# EAGLE design 12706 (EAGLE 6.6.0)
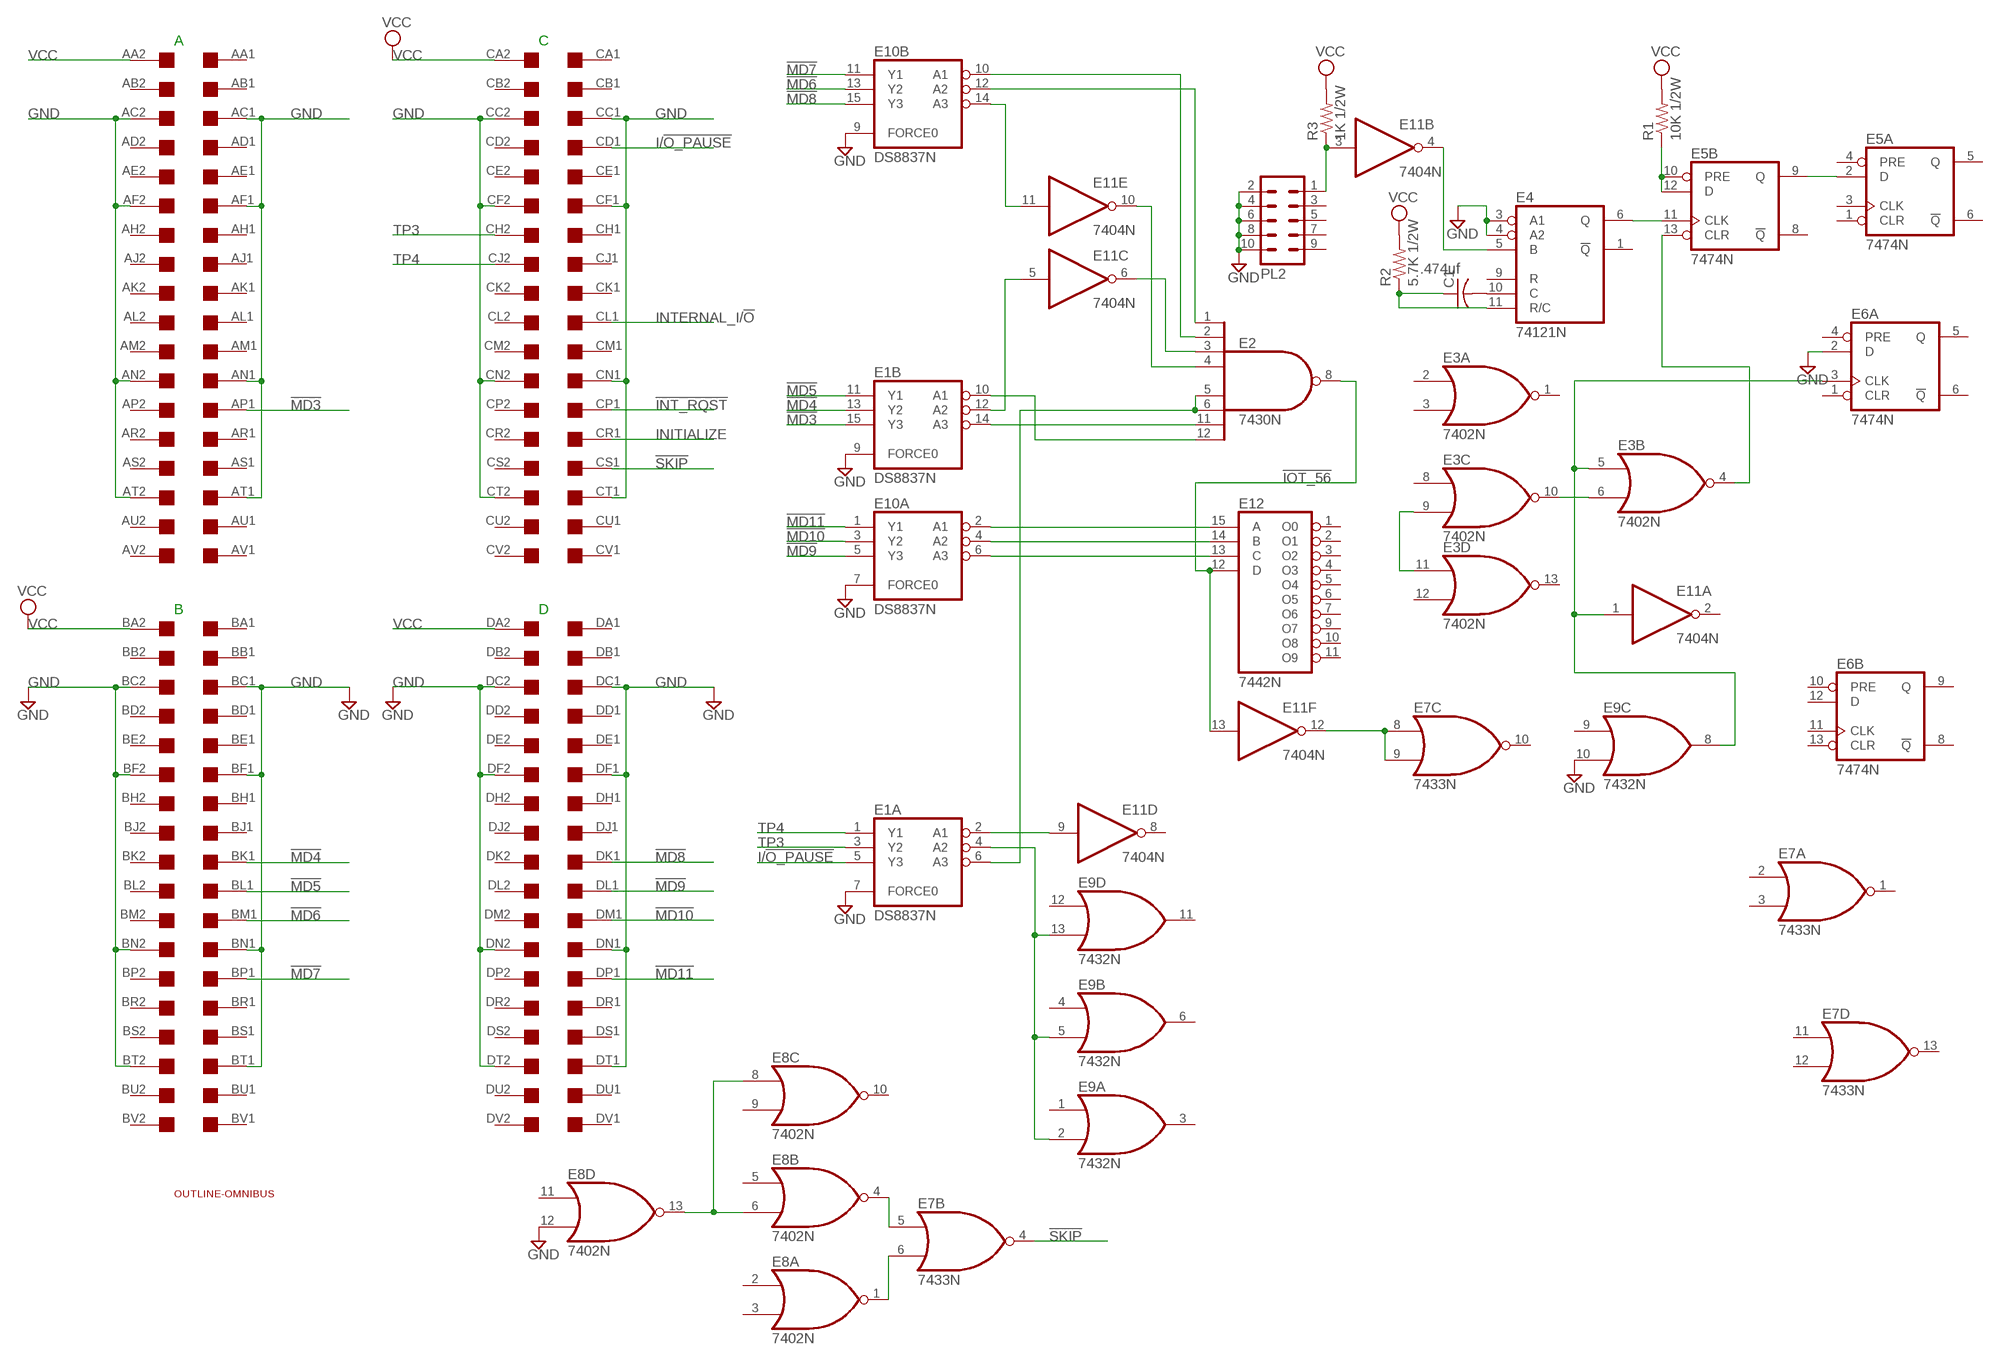
[diagram p0: schematic, sheet 1]

## Parts
C1  .474uf  C-US050-045X075  [C050-045X075]
E1  DS8837N  [DIL16]
E2  7430N  [DIL14]
E3  7402N  [DIL14]
E4  74121N  [DIL14]
E5  7474N  74S74N  [DIL14]
E6  7474N  74S74N  [DIL14]
E7  7433N  74LS33N  [DIL14]
E8  7402N  [DIL14]
E9  7432N  [DIL14]
E10  DS8837N  [DIL16]
E11  7404N  [DIL14]
E12  7442N  74LS42N  [DIL16]
PL2  10H  [10H]
R1  10K 1/2W  R-US_0204/7  [0204/7]
R2  5.7K 1/2W  R-US_0204/7  [0204/7]
R3  1K 1/2W  R-US_0204/7  [0204/7]
U$1  QUAD  [EDGE-CON8]
U$2  OUTLINE-OMNIBUS  [OMNIBUS]

## Nets
!INT_RQST: U$1.CP1
!IOT_56: E2.8(O) E11.13(F:I) E12.12(D)
!MD3: E1.15(B:Y3) U$1.AP1
!MD4: E1.13(B:Y2) U$1.BK1
!MD5: E1.11(B:Y1) U$1.BL1
!MD6: E10.13(B:Y2) U$1.BM1
!MD7: E10.11(B:Y1) U$1.BP1
!MD8: E10.15(B:Y3) U$1.DK1
!MD9: E10.5(A:Y3) U$1.DL1
!MD10: E10.3(A:Y2) U$1.DM1
!MD11: E10.1(A:Y1) U$1.DP1
!SKIP [Power]: E7.4(B:O) U$1.CS1
GND [Power]: E1.7(A:FORCE0) E1.9(B:FORCE0) E4.3(A1) E4.4(A2) E6.2(A:D) E8.12(D:I1) E9.10(C:I1) E10.7(A:FORCE0) E10.9(B:FORCE0) PL2.2 PL2.4 PL2.6 PL2.8 PL2.10 U$1.AC1 U$1.AC2 U$1.AF1 U$1.AF2 U$1.AN1 U$1.AN2 U$1.AT1 U$1.AT2 U$1.BC1 U$1.BC2 U$1.BF1 U$1.BF2 U$1.BN1 U$1.BN2 U$1.BT1 U$1.BT2 U$1.CC1 U$1.CC2 U$1.CF1 U$1.CF2 U$1.CN1 U$1.CN2 U$1.CT1 U$1.CT2 U$1.DC1 U$1.DC2 U$1.DF1 U$1.DF2 U$1.DN1 U$1.DN2 U$1.DT1 U$1.DT2
I/!O_PAUSE: E1.5(A:Y3) U$1.CD1
INITIALIZE: U$1.CR1
INTERNAL_I/!O: U$1.CL1
N$1: E1.14(B:A3) E2.11(I6)
N$2: E1.10(B:A1) E2.12(I7)
N$3: E10.2(A:A1) E12.15(A)
N$4: E10.4(A:A2) E12.14(B)
N$5: E10.6(A:A3) E12.13(C)
N$6 [Power]: E7.6(B:I1) E8.1(A:O)
N$7: E7.8(C:I0) E7.9(C:I1) E11.12(F:O)
N$8: E1.2(A:A1) E11.9(D:I)
N$9 [Power]: E1.4(A:A2) E9.2(A:I1) E9.5(B:I1) E9.13(D:I1)
N$10: E1.6(A:A3) E2.5(I4) E2.6(I5)
N$11: E2.4(I3) E11.10(E:O)
N$12: E2.1(I0) E10.12(B:A2)
N$13: E2.2(I1) E10.10(B:A1)
N$14: E2.3(I2) E11.6(C:O)
N$15: E1.12(B:A2) E11.5(C:I)
N$16: E10.14(B:A3) E11.11(E:I)
N$17: E7.5(B:I0) E8.4(B:O)
N$18: E8.6(B:I1) E8.8(C:I0) E8.13(D:O)
N$19: C1.1 E4.11(R/C) R2.1
N$20: E5.2(A:D) E5.9(B:Q)
N$21: E5.10(B:PRE) E5.12(B:D) R1.1
N$22: E3.6(B:I1) E3.10(C:O)
N$23: E3.9(C:I1) E3.11(D:I0)
N$24: C1.2 E4.10(C)
N$25: E4.6(Q) E5.11(B:CLK)
N$26: E4.5(B) E11.4(B:O)
N$27: E11.3(B:I) PL2.1 R3.1
N$29: E3.4(B:O) E5.13(B:CLR)
N$30: E3.5(B:I0) E6.3(A:CLK) E9.8(C:O) E11.1(A:I)
TP3: E1.3(A:Y2) U$1.CH2
TP4: E1.1(A:Y1) U$1.CJ2
VCC [Power]: R1.2 R2.2 R3.2 U$1.AA2 U$1.BA2 U$1.CA2 U$1.DA2
Unconnected: E3.1(A:O) E3.2(A:I0) E3.3(A:I1) E3.8(C:I0) E3.12(D:I1) E3.13(D:O) E4.1(!Q) E4.9(R) E5.1(A:CLR) E5.3(A:CLK) E5.4(A:PRE) E5.5(A:Q) E5.6(A:!Q) E5.8(B:!Q) E6.1(A:CLR) E6.4(A:PRE) E6.5(A:Q) E6.6(A:!Q) E6.8(B:!Q) E6.9(B:Q) E6.10(B:PRE) E6.11(B:CLK) E6.12(B:D) E6.13(B:CLR) E7.1(A:O) E7.2(A:I0) E7.3(A:I1) E7.10(C:O) E7.11(D:I0) E7.12(D:I1) E7.13(D:O) E8.2(A:I0) E8.3(A:I1) E8.5(B:I0) E8.9(C:I1) E8.10(C:O) E8.11(D:I0) E9.1(A:I0) E9.3(A:O) E9.4(B:I0) E9.6(B:O) E9.9(C:I0) E9.11(D:O) E9.12(D:I0) E11.2(A:O) E11.8(D:O) E12.1(O0) E12.2(O1) E12.3(O2) E12.4(O3) E12.5(O4) E12.6(O5) E12.7(O6) E12.9(O7) E12.10(O8) E12.11(O9) PL2.3 PL2.5 PL2.7 PL2.9 U$1.AA1 U$1.AB1 U$1.AB2 U$1.AD1 U$1.AD2 U$1.AE1 U$1.AE2 U$1.AH1 U$1.AH2 U$1.AJ1 U$1.AJ2 U$1.AK1 U$1.AK2 U$1.AL1 U$1.AL2 U$1.AM1 U$1.AM2 U$1.AP2 U$1.AR1 U$1.AR2 U$1.AS1 U$1.AS2 U$1.AU1 U$1.AU2 U$1.AV1 U$1.AV2 U$1.BA1 U$1.BB1 U$1.BB2 U$1.BD1 U$1.BD2 U$1.BE1 U$1.BE2 U$1.BH1 U$1.BH2 U$1.BJ1 U$1.BJ2 U$1.BK2 U$1.BL2 U$1.BM2 U$1.BP2 U$1.BR1 U$1.BR2 U$1.BS1 U$1.BS2 U$1.BU1 U$1.BU2 U$1.BV1 U$1.BV2 U$1.CA1 U$1.CB1 U$1.CB2 U$1.CD2 U$1.CE1 U$1.CE2 U$1.CH1 U$1.CJ1 U$1.CK1 U$1.CK2 U$1.CL2 U$1.CM1 U$1.CM2 U$1.CP2 U$1.CR2 U$1.CS2 U$1.CU1 U$1.CU2 U$1.CV1 U$1.CV2 U$1.DA1 U$1.DB1 U$1.DB2 U$1.DD1 U$1.DD2 U$1.DE1 U$1.DE2 U$1.DH1 U$1.DH2 U$1.DJ1 U$1.DJ2 U$1.DK2 U$1.DL2 U$1.DM2 U$1.DP2 U$1.DR1 U$1.DR2 U$1.DS1 U$1.DS2 U$1.DU1 U$1.DU2 U$1.DV1 U$1.DV2

## Notes on the sheet
- A | C
- B | D

## Power pins joined to a net without a drawn wire
GND: E1.8(P:GND) E2.7(GND) E3.7(P:GND) E4.7(GND) E5.7(P:GND) E6.7(P:GND) E7.7(P:GND) E8.7(P:GND) E9.7(P:GND) E10.8(P:GND) E11.7(P:GND) E12.8(GND)
VCC: E1.16(P:VCC) E2.14(VCC) E3.14(P:VCC) E4.14(VCC) E5.14(P:VCC) E6.14(P:VCC) E7.14(P:VCC) E8.14(P:VCC) E9.14(P:VCC) E10.16(P:VCC) E11.14(P:VCC) E12.16(VCC)

## Library data of the parts
C1 = rcl:C-US: CAPACITOR, American symbol
E1 E10 = dec-con:DS8837: Hex inverting LINE RECEIVER
E2 = 74xx-us:74*30: 8-input NAND gate
E3 E8 = 74xx-us:74*02: Quad 2-input NOR gate
E4 = 74xx-us:74*121: Monostable MULTIVIBRATOR, schmitt trigger inputs
E5 E6 = 74xx-us:74*74: Dual D type positive edge triggered FLIP FLOP, preset and clear
E7 = 74xx-us:74*33: Quad 2-input NOR buffer, open collector
E9 = 74xx-us:74*32: Quad 2-input OR gate
E11 = 74xx-us:74*04: Hex INVERTER
E12 = 74xx-us:74*42: 4-line to 10-line DECODER (1-of-10)
PL2 = con-harting-h:10H: CONNECTOR; OC_FARNELL: unknown; OC_NEWARK: unknown
R1-R3 = rcl:R-US_: RESISTOR, American symbol
U$1 = dec-con:QUAD: Quad-Height DEC board
U$2 = dec-con:OUTLINE-*: Board outlines for DEC boards.

## Net classes
1 Power: width 0.381 mm, drill 0.381 mm, clearance 0.381 mm

## Board
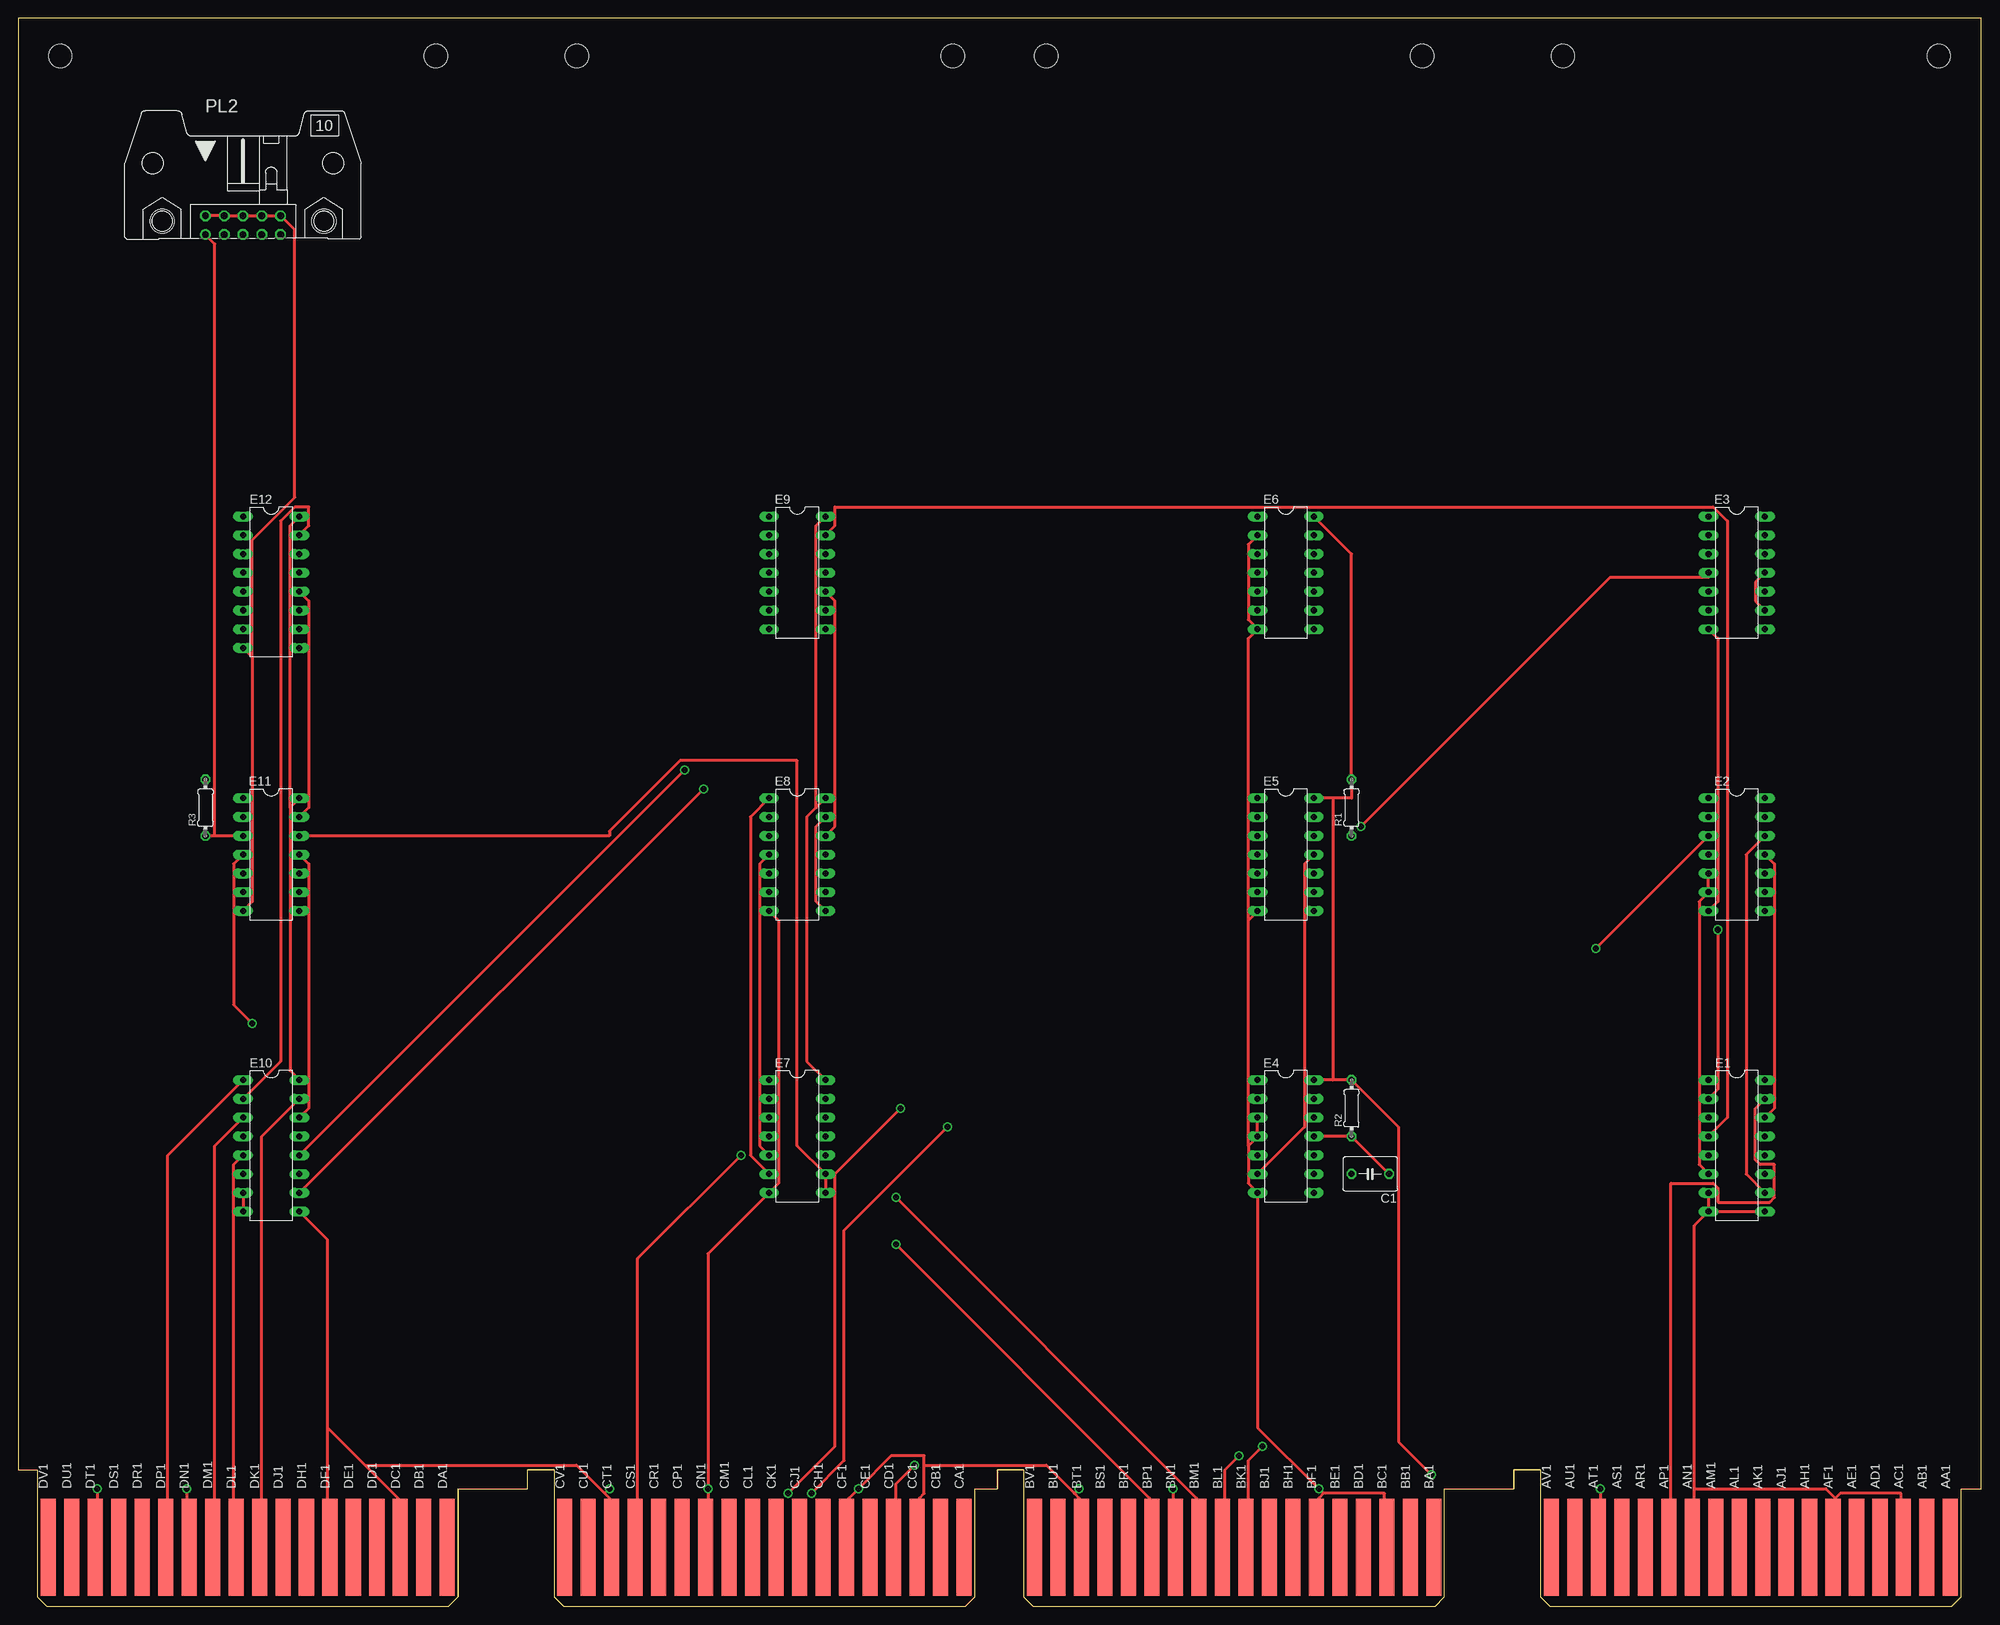
[diagram p1: board, top side]
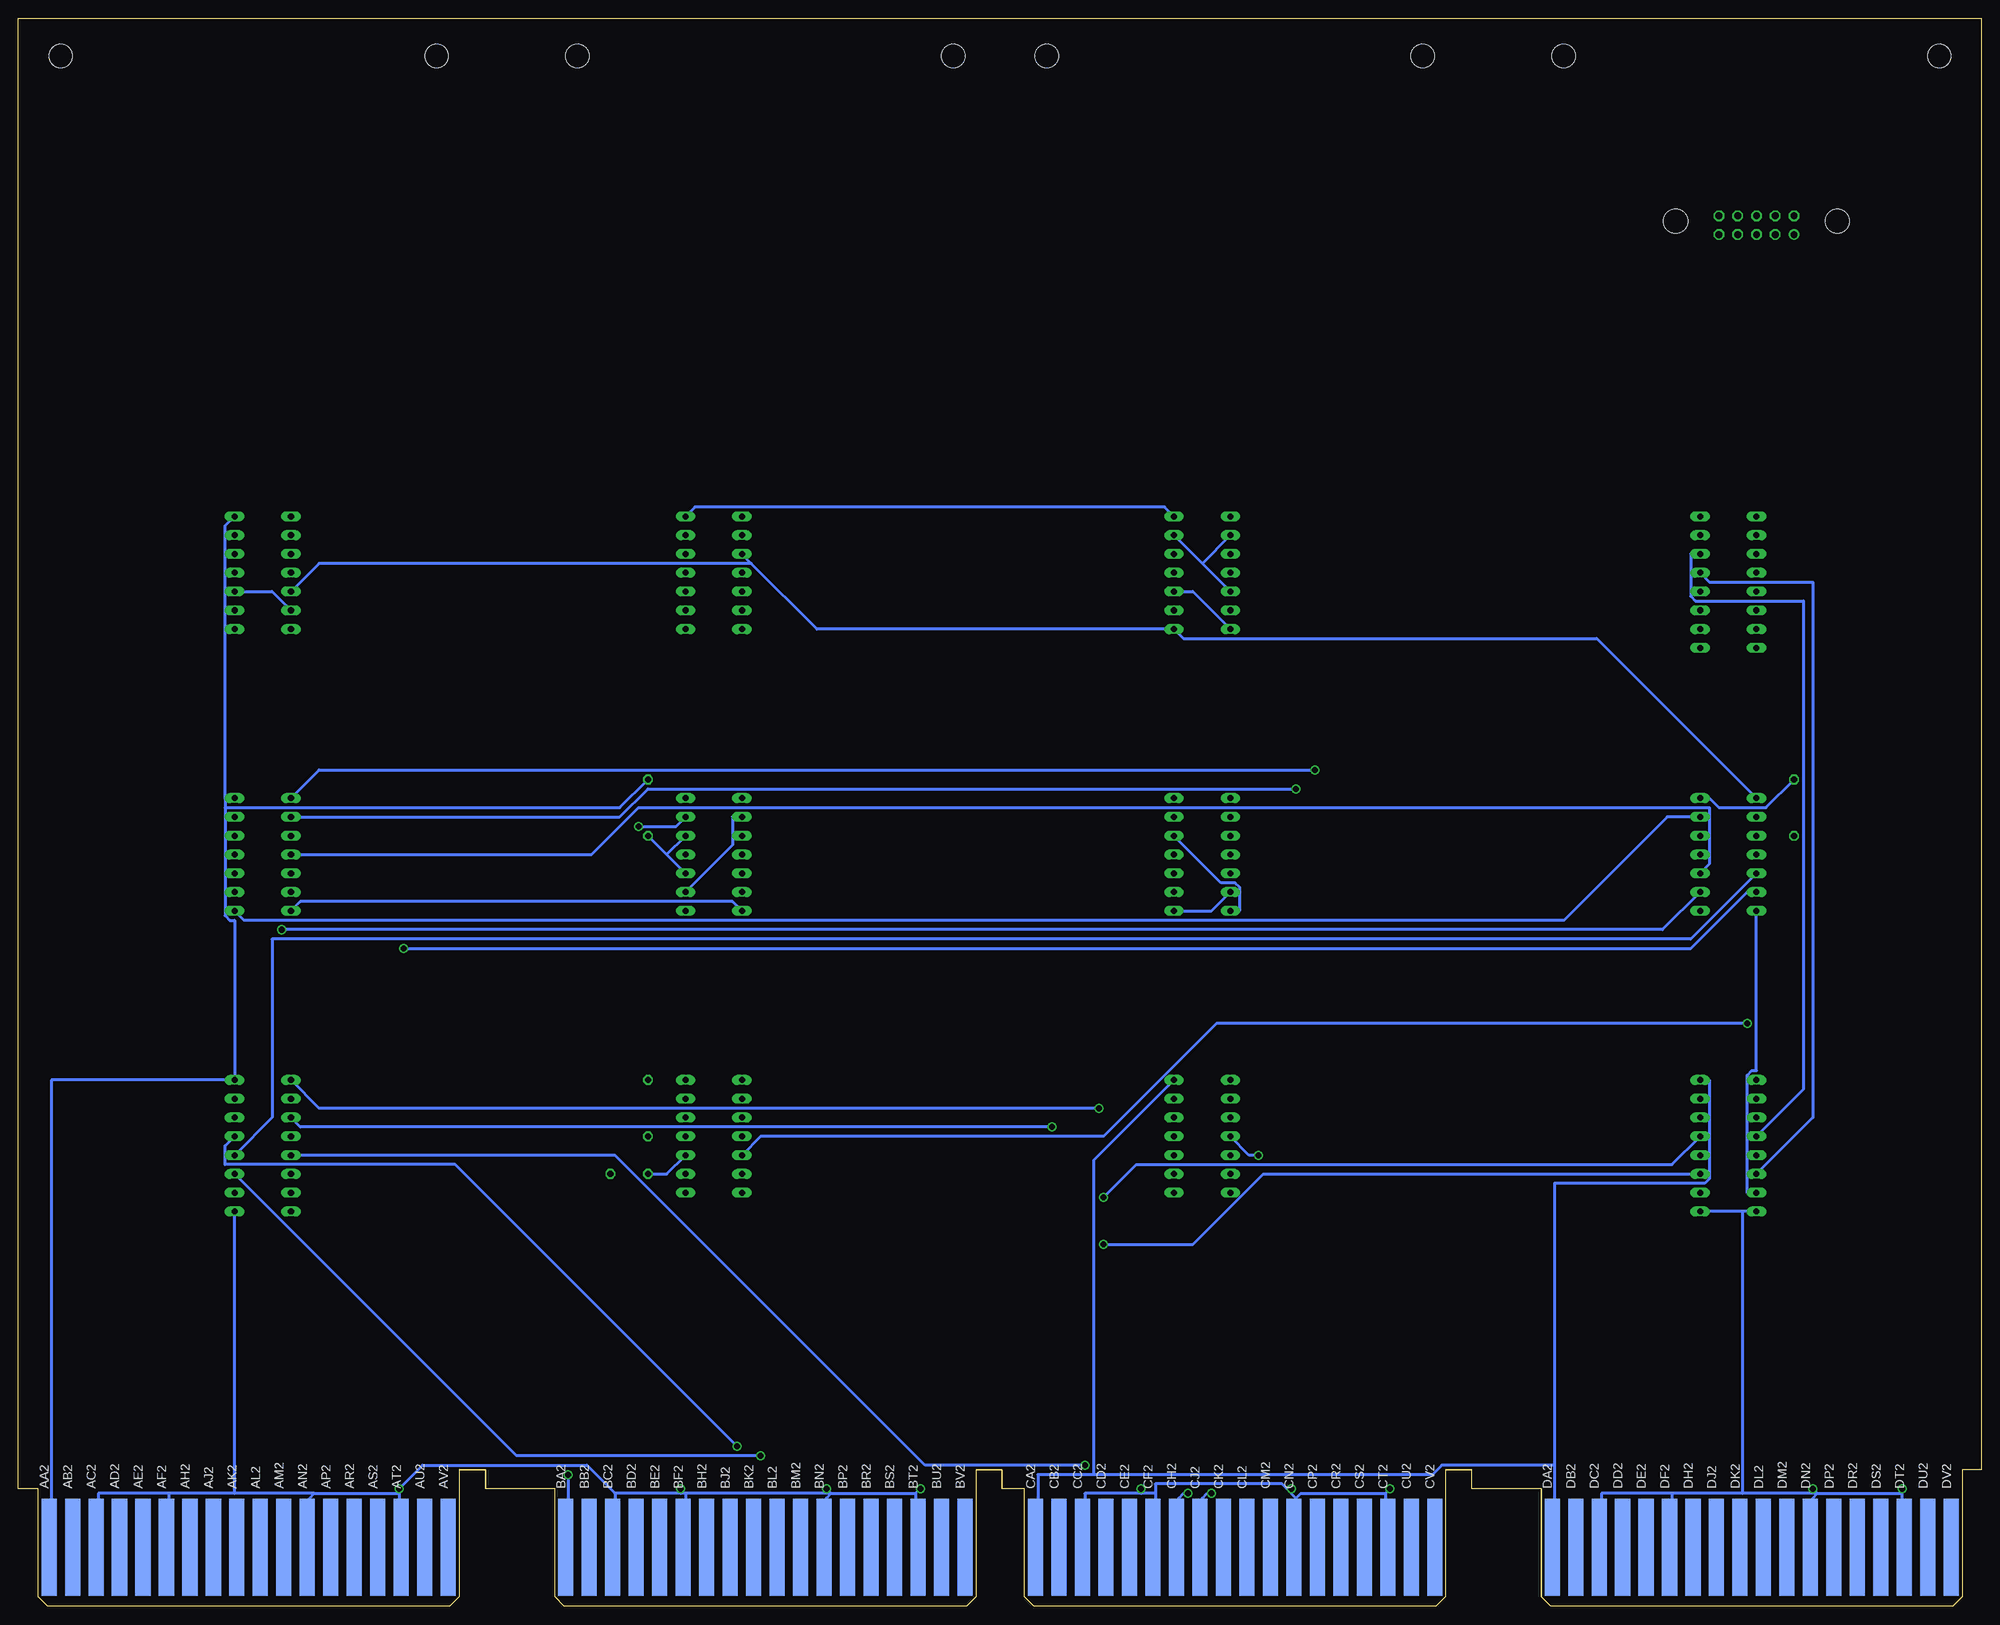
[diagram p2: board, bottom side, seen from below]

Size 265.3 x 214.63 mm. Coordinates in mm from the lower left corner, seen from the top.
Copper layers (1+16): Top 0.035mm / dielectric 1.5mm / Bottom 0.035mm
Design rules "16mils": minimum track width 16mil, minimum drill 32mil, track to track 15mil, track to pad 10mil, pad to pad 10mil, via to via 10mil, smd to smd 10mil, copper to edge 13mil, drill to drill 10mil, minimum pad ring 10mil, minimum via ring 8mil, stop-mask expansion 0mil, vias tented up to drill 0mil, thermal gap 10mil

### Footprints (pad centres in the part's own frame; a part is rotated, then mirrored left to right if it is on the bottom)
C050-045X075 = drill 0.813 octagon: 1 -2.54,0; 2 2.54,0
DIL16 = drill 0.813 long: 1 -8.89,-3.81; 2 -6.35,-3.81; 3 -3.81,-3.81; 4 -1.27,-3.81; 5 1.27,-3.81; 6 3.81,-3.81; 7 6.35,-3.81; 8 8.89,-3.81; 9 8.89,3.81; 10 6.35,3.81; 11 3.81,3.81; 12 1.27,3.81; 13 -1.27,3.81; 14 -3.81,3.81; 15 -6.35,3.81; 16 -8.89,3.81
DIL14 = drill 0.813 long: 1 -7.62,-3.81; 2 -5.08,-3.81; 3 -2.54,-3.81; 4 0,-3.81; 5 2.54,-3.81; 6 5.08,-3.81; 7 7.62,-3.81; 8 7.62,3.81; 9 5.08,3.81; 10 2.54,3.81; 11 0,3.81; 12 -2.54,3.81; 13 -5.08,3.81; 14 -7.62,3.81
10H = drill 0.914: 1 -5.08,-1.27 | drill 0.914 octagon: 2 -5.08,1.27; 3 -2.54,-1.27; 4 -2.54,1.27; 5 0,-1.27; 6 0,1.27; 7 2.54,-1.27; 8 2.54,1.27; 9 5.08,-1.27; 10 5.08,1.27 | hole 3.302: -10.922,0.533; 10.922,0.533
0204/7 = drill 0.813 octagon: 1 -3.81,0; 2 3.81,0
EDGE-CON8 = smd 2.032 x 13.106: AA1 261.303,7.938; AB1 258.127,7.938; AC1 254.952,7.938; AD1 251.778,7.938; AE1 248.602,7.938; AF1 245.428,7.938; AH1 242.252,7.938; AJ1 239.077,7.938; AK1 235.903,7.938; AL1 232.727,7.938; AM1 229.553,7.938; AN1 226.377,7.938; AP1 223.202,7.938; AR1 220.028,7.938; AS1 216.852,7.938; AT1 213.678,7.938; AU1 210.502,7.938; AV1 207.327,7.938; BA1 191.452,7.938; BB1 188.278,7.938; BC1 185.102,7.938; BD1 181.928,7.938; BE1 178.752,7.938; BF1 175.577,7.938; BH1 172.403,7.938; BJ1 169.227,7.938; BK1 166.053,7.938; BL1 162.877,7.938; BM1 159.702,7.938; BN1 156.528,7.938; BP1 153.352,7.938; BR1 150.178,7.938; BS1 147.002,7.938; BT1 143.827,7.938; BU1 140.653,7.938; BV1 137.477,7.938; CA1 127.953,7.938; CB1 124.778,7.938; CC1 121.603,7.938; CD1 118.427,7.938; CE1 115.252,7.938; CF1 112.078,7.938; CH1 108.903,7.938; CJ1 105.728,7.938; CK1 102.552,7.938; CL1 99.377,7.938; CM1 96.203,7.938; CN1 93.028,7.938; CP1 89.853,7.938; CR1 86.677,7.938; CS1 83.502,7.938; CT1 80.328,7.938; CU1 77.153,7.938; CV1 73.978,7.938; DA1 58.102,7.938; DB1 54.928,7.938; DC1 51.752,7.938; DD1 48.578,7.938; DE1 45.403,7.938; DF1 42.227,7.938; DH1 39.053,7.938; DJ1 35.877,7.938; DK1 32.703,7.938; DL1 29.527,7.938; DM1 26.352,7.938; DN1 23.177,7.938; DP1 20.003,7.938; DR1 16.828,7.938; DS1 13.652,7.938; DT1 10.477,7.938; DU1 7.303,7.938; DV1 4.128,7.938 | smd 2.032 x 13.106 bottom: AA2 261.303,7.938; AB2 258.127,7.938; AC2 254.952,7.938; AD2 251.778,7.938; AE2 248.602,7.938; AF2 245.428,7.938; AH2 242.252,7.938; AJ2 239.077,7.938; AK2 235.903,7.938; AL2 232.727,7.938; AM2 229.553,7.938; AN2 226.377,7.938; AP2 223.202,7.938; AR2 220.028,7.938; AS2 216.852,7.938; AT2 213.678,7.938; AU2 210.502,7.938; AV2 207.327,7.938; BA2 191.452,7.938; BB2 188.278,7.938; BC2 185.102,7.938; BD2 181.928,7.938; BE2 178.752,7.938; BF2 175.577,7.938; BH2 172.403,7.938; BJ2 169.227,7.938; BK2 166.053,7.938; BL2 162.877,7.938; BM2 159.702,7.938; BN2 156.528,7.938; BP2 153.352,7.938; BR2 150.178,7.938; BS2 147.002,7.938; BT2 143.827,7.938; BU2 140.653,7.938; BV2 137.477,7.938; CA2 127.953,7.938; CB2 124.778,7.938; CC2 121.603,7.938; CD2 118.427,7.938; CE2 115.252,7.938; CF2 112.078,7.938; CH2 108.903,7.938; CJ2 105.728,7.938; CK2 102.552,7.938; CL2 99.377,7.938; CM2 96.203,7.938; CN2 93.028,7.938; CP2 89.853,7.938; CR2 86.677,7.938; CS2 83.502,7.938; CT2 80.328,7.938; CU2 77.153,7.938; CV2 73.978,7.938; DA2 58.102,7.938; DB2 54.928,7.938; DC2 51.752,7.938; DD2 48.578,7.938; DE2 45.403,7.938; DF2 42.227,7.938; DH2 39.053,7.938; DJ2 35.877,7.938; DK2 32.703,7.938; DL2 29.527,7.938; DM2 26.352,7.938; DN2 23.177,7.938; DP2 20.003,7.938; DR2 16.828,7.938; DS2 13.652,7.938; DT2 10.477,7.938; DU2 7.303,7.938; DV2 4.128,7.938
OMNIBUS = hole 3.175: 208.915,209.55; 259.715,209.55; 189.865,209.55; 139.065,209.55; 75.616,209.55; 126.416,209.55; 56.566,209.55; 5.766,209.55

### Placement (x,y rotation side)
C1  182.75,58.42 180 top
E1  232.28,62.23 270 top
E2  232.28,101.6 270 top
E3  232.28,139.7 270 top
E4  171.32,63.5 270 top
E5  171.32,101.6 270 top
E6  171.32,139.7 270 top
E7  105.28,63.5 270 top
E8  105.28,101.6 270 top
E9  105.28,139.7 270 top
E10  34.16,62.23 270 top
E11  34.16,101.6 270 top
E12  34.16,138.43 270 top
PL2  30.35,186.69 0 top
R1  180.21,107.95 90 top
R2  180.21,67.31 90 top
R3  25.27,107.95 90 top
U$1  -0.13,0 0 top
U$2  -0.13,0 0 top

### Tracks (layer width: path | path; a pad name or v marks a point on that pad's centre or on a via)
!IOT_56
  Top 0.406: E11.13 39.24,107.95 39.24,135.89 E12.12
  Bottom 0.406: E2.8 234.82,92.71 56.39,92.71 42.42,106.68 E11.13
!MD3
  Top 0.406: E1.15 234.82,67.31 234.82,60.33 235.46,59.69 237.36,59.69 237.36,55.24 236.73,54.61 229.74,54.61 229.74,56.52 229.11,57.15 223.39,57.15 223.39,8.26 U$1.AP1
!MD4  (via drill 0.81)
  Top 0.406: v168.15,21.59 166.24,19.68 166.24,8.26 U$1.BK1
  Bottom 0.406: E1.13 237.36,62.23 237.36,59.69 206.25,59.69 v168.15,21.59
!MD5  (via drill 0.81)
  Top 0.406: v164.97,20.32 163.07,18.41 163.07,8.26 U$1.BL1
  Bottom 0.406: E1.11 197.99,20.32 v164.97,20.32
!MD6  (via drill 0.81)
  Top 0.406: v118.62,55.24 159.26,14.61 159.26,8.26 U$1.BM1
  Bottom 0.406: E10.13 41.78,59.69 114.17,59.69 v118.62,55.24
!MD7  (via drill 0.81)
  Top 0.406: v118.62,48.9 152.91,14.61 152.91,8.26 U$1.BP1
  Bottom 0.406: E10.11 97.03,58.42 106.55,48.9 v118.62,48.9
!MD8
  Top 0.406: E10.15 32.89,63.5 32.89,8.26 U$1.DK1
!MD9
  Top 0.406: E10.5 29.08,59.69 29.08,8.26 U$1.DL1
!MD10
  Top 0.406: E10.3 26.54,62.23 26.54,8.26 U$1.DM1
!MD11
  Top 0.406: E10.1 20.19,60.96 20.19,8.26 U$1.DP1
!SKIP  (via drill 0.81)
  Top 0.406: v97.66,60.96 83.69,46.99 83.69,8.26 U$1.CS1
  Bottom 0.406: E7.4 98.93,60.96 v97.66,60.96
GND  (via drill 0.81)
  Top 0.406: PL2.2 PL2.4 PL2.6 PL2.8 PL2.10 37.34,186.06 37.34,149.86 31.62,144.15 31.62,128.27 | E11.7 31.62,95.25 31.62,128.27 | E12.8 31.62,128.27 | v10.67,15.88 10.67,8.26 U$1.DT2 | v22.73,15.88 22.73,8.26 U$1.DN2 | E10.7 E10.8 | E10.9 41.78,49.53 41.78,24.13 | 41.78,24.13 41.78,8.26 U$1.DF2 | 41.78,24.13 46.86,19.05 | 46.86,19.05 51.31,14.61 51.31,8.26 U$1.DC2 | 79.25,15.24 75.44,19.05 46.86,19.05 | 79.25,15.24 79.88,14.61 79.88,8.26 U$1.CT1 | 122.43,19.05 122.43,15.24 121.79,14.61 121.79,8.26 U$1.CC1 | 122.43,19.05 122.43,20.32 117.98,20.32 v113.54,15.88 112.27,14.61 112.27,8.26 U$1.CF1 | 142.75,15.24 138.94,19.05 122.43,19.05 | 142.75,15.24 143.38,14.61 143.38,8.26 U$1.BT2 | E8.7 102.74,92.71 102.74,57.15 E7.7 93.22,47.62 v93.22,15.88 93.22,8.26 U$1.CN1 | E9.10 110.36,135.89 110.36,105.41 E8.12 | 245.62,14.61 245.62,8.26 U$1.AF1 | 245.62,14.61 246.25,15.24 254.51,15.24 254.51,8.26 U$1.AC1 | E1.7 E1.8 | E1.8 E1.9 | E1.8 226.57,51.44 226.57,15.88 | 226.57,15.88 226.57,8.26 U$1.AN1 | 245.62,14.61 244.35,15.88 226.57,15.88 | v156.08,15.88 156.08,8.26 U$1.BN2 | v213.87,15.88 213.87,8.26 U$1.AT1 | 176.4,15.24 175.77,14.61 175.77,8.26 U$1.BF2 | 176.4,15.24 184.66,15.24 184.66,8.26 U$1.BC2 | E2.7 229.74,95.25 229.74,130.81 E3.7 | E6.2 166.24,143.51 166.24,133.35 E6.7 166.24,130.81 166.24,92.71 | 166.24,62.23 166.24,57.15 E4.7 167.51,24.13 v175.77,15.88 176.4,15.24 | 166.24,62.23 E4.4 E4.3 | 166.24,92.71 E5.7 | 166.24,62.23 166.24,92.71 | v143.38,15.88 142.75,15.24 | v79.88,15.88 79.25,15.24
  Bottom 0.406: 10.67,15.24 10.67,8.26 U$1.DT2 | 10.67,15.24 v10.67,15.88 | 22.1,15.24 10.67,15.24 | 22.1,15.24 22.73,14.61 22.73,8.26 U$1.DN2 | 22.1,15.24 v22.73,15.88 | 41.78,15.24 41.78,8.26 U$1.DF2 | 22.1,15.24 32.26,15.24 | 32.26,15.24 41.78,15.24 | 41.78,15.24 51.31,15.24 51.31,8.26 U$1.DC2 | E10.8 32.26,53.34 | 32.26,53.34 E10.9 | 32.26,53.34 32.26,15.24 | E11.7 30.35,72.39 30.99,72.39 31.62,71.75 31.62,55.88 E10.7 | 80.52,15.24 80.52,8.26 U$1.CT1 | 80.52,15.24 91.95,15.24 92.58,14.61 | 92.58,14.61 92.58,8.26 U$1.CN1 | 111.63,15.24 111.63,16.51 94.49,16.51 93.85,15.88 | 111.63,15.24 111.63,8.26 U$1.CF1 | 92.58,14.61 93.85,15.88 | 111.63,15.24 113.54,15.24 | 113.54,15.24 121.16,15.24 121.16,8.26 U$1.CC1 | 113.54,15.24 v113.54,15.88 | E9.7 106.55,137.16 E9.10 | E8.12 102.74,97.79 100.84,97.79 100.2,97.16 100.2,93.98 E8.7 | v93.22,15.88 93.85,15.88 | 144.02,15.24 144.02,8.26 U$1.BT2 | 155.45,15.24 144.02,15.24 | 155.45,15.24 156.08,14.61 156.08,8.26 U$1.BN2 | 155.45,15.24 v156.08,15.88 | 175.13,15.24 175.13,8.26 U$1.BF2 | 155.45,15.24 175.13,15.24 | 184.66,15.24 184.66,8.26 U$1.BC2 | 175.13,15.24 175.77,15.24 | 175.77,15.24 184.66,15.24 | 213.87,15.24 213.87,8.26 U$1.AT1 | 225.3,15.24 213.87,15.24 | 225.3,15.24 225.93,14.61 225.93,8.26 U$1.AN1 | 213.87,15.24 v213.87,15.88 210.69,19.05 188.47,19.05 184.66,15.24 | 244.98,15.24 244.98,8.26 U$1.AF1 | 225.3,15.24 236.09,15.24 | 236.09,15.24 244.98,15.24 | 244.98,15.24 254.51,15.24 254.51,8.26 U$1.AC1 | 236.09,15.24 E1.9 | E2.7 227.2,95.25 168.78,95.25 E5.7 | v175.77,15.88 175.77,15.24 | 144.02,15.24 v143.38,15.88 | 80.52,15.24 v79.88,15.88
I/!O_PAUSE  (via drill 0.81)
  Top 0.406: v121.16,19.05 118.62,16.51 118.62,8.26 U$1.CD1
  Bottom 0.406: E1.5 184.66,60.96 142.75,19.05 v121.16,19.05
N$1
  Top 0.406: E1.14 237.36,67.31 237.36,100.33 E2.11
N$2
  Top 0.406: E1.10 233.55,58.42 233.55,101.6 E2.12
N$3
  Top 0.406: E10.2 35.43,73.66 35.43,146.69 37.34,148.59 39.24,148.59 39.24,146.05 E12.15
N$4
  Bottom 0.406: E10.4 24,69.85 24,135.89 38.61,135.89 39.24,136.53 39.24,142.24 E12.14
N$5
  Bottom 0.406: E10.6 22.73,66.04 22.73,138.43 36.7,138.43 E12.13
N$6
  Top 0.406: E7.6 98.93,60.96 98.93,106.68 E8.1
N$7
  Top 0.406: E7.8 E7.9 105.28,62.23 105.28,114.3 89.41,114.3 79.88,104.78 79.88,104.14 E11.12
N$8  (via drill 0.81)
  Top 0.406: E1.2 229.74,69.85 v229.74,91.44
  Bottom 0.406: v229.74,91.44 43.05,91.44 E11.9
N$9
  Top 0.406: E1.4 231.01,66.04 231.01,146.69 229.11,148.59 110.36,148.59 110.36,146.05 E9.13
  Bottom 0.406: E9.13 105.28,140.97 | 105.28,140.97 E9.5 | 105.28,140.97 E9.2
N$10
  Top 0.406: E1.6 227.2,59.69 227.2,95.25 E2.6 E2.5
N$11
  Bottom 0.406: E11.10 36.7,100.33 36.7,107.95 181.48,107.95 187.83,101.6 E2.4
N$12  (via drill 0.81)
  Top 0.406: v90.04,113.03 E10.12
  Bottom 0.406: v90.04,113.03 224.66,113.03 E2.1
N$13  (via drill 0.81)
  Top 0.406: v92.58,110.49 E10.10
  Bottom 0.406: v92.58,110.49 180.21,110.49 184.02,106.68 E2.2
N$14  (via drill 0.81)
  Top 0.406: E2.3 v213.23,88.9
  Bottom 0.406: E11.6 31.62,96.52 39.24,88.9 v213.23,88.9
N$15
  Bottom 0.406: E1.12 231.01,66.04 231.01,90.17 39.24,90.17 E11.5
N$16
  Top 0.406: E10.14 39.24,67.31 39.24,100.33 E11.11
N$17
  Top 0.406: E7.5 100.2,62.23 100.2,100.33 E8.4
N$18
  Top 0.406: E8.13 107.82,105.41 107.82,95.25 E8.8
  Bottom 0.406: E8.6 104.01,93.98 E8.8
N$19
  Top 0.406: E4.11 R2.1 C1.1
N$20
  Bottom 0.406: E5.9 168.78,102.87 168.78,106.68 E5.2
N$21
  Bottom 0.406: R1.1 177.67,101.6 | 177.67,101.6 E5.10 | 177.67,101.6 E5.12
N$22
  Bottom 0.406: E3.6 231.01,137.16 E3.10
N$23
  Top 0.406: E3.9 234.82,135.89 234.82,138.43 E3.11
N$24
  Bottom 0.406: E4.10 177.67,58.42 C1.2
N$25
  Top 0.406: E4.6 173.86,64.77 173.86,100.33 E5.11
N$26  (via drill 0.81)
  Top 0.406: v31.62,78.74 29.08,81.28 29.08,100.33 E11.4
  Bottom 0.406: E4.5 164.97,63.5 118.62,63.5 103.38,78.74 v31.62,78.74
N$27
  Top 0.406: E11.3 26.54,104.14 | 26.54,104.14 R3.1 | PL2.1 26.54,184.15 26.54,104.14
N$29  (via drill 0.81)
  Top 0.406: v181.48,105.41 215.14,139.06 228.47,139.06 E3.4
  Bottom 0.406: E5.13 176.4,105.41 v181.48,105.41
N$30
  Bottom 0.406: E11.1 51.94,130.81 107.82,130.81 E9.8 157.35,132.08 166.24,140.97 | 166.24,140.97 E6.3 | E3.5 224.66,140.97 166.24,140.97
TP3  (via drill 0.81)
  Top 0.406: v125.6,64.77 111.63,50.8 111.63,19.68 v107.19,15.24
  Bottom 0.406: E1.3 227.2,64.77 v125.6,64.77 | v107.19,15.24 107.82,15.24 108.46,14.61 108.46,8.26 U$1.CH2
TP4  (via drill 0.81)
  Top 0.406: v119.25,67.31 110.36,58.42 110.36,21.59 v104.01,15.24
  Bottom 0.406: E1.1 224.66,67.31 v119.25,67.31 | v104.01,15.24 104.65,15.24 105.28,14.61 105.28,8.26 U$1.CJ2
VCC  (via drill 0.81)
  Top 0.406: 177.67,71.12 R2.2 186.56,64.77 186.56,22.23 v191.01,17.78 | 177.67,71.12 E4.14 | 177.67,109.22 180.21,109.22 R1.2 180.21,142.24 E6.14 | 177.67,109.22 E5.14 | 177.67,109.22 177.67,71.12 | E7.14 106.55,73.66 106.55,106.68 107.82,107.95 | E8.14 107.82,107.95 | E9.14 107.82,146.05 107.82,107.95 | E10.16 36.7,72.39 36.7,107.95 | E11.14 36.7,107.95 | E12.16 36.7,146.05 36.7,107.95
  Bottom 0.406: v191.01,17.78 191.01,8.26 U$1.BA2 | 237.36,109.22 237.36,107.95 | 237.36,107.95 237.36,93.34 236.73,92.71 236.09,92.71 E1.16 260.86,71.12 260.86,8.26 U$1.AA2 | E2.14 237.36,109.22 | E3.14 237.36,146.05 237.36,109.22 | R1.2 184.02,107.95 237.36,107.95 | R3.2 29.08,107.95 35.43,107.95 36.7,109.22 E11.14 | 57.66,19.05 57.66,57.15 37.34,57.15 36.7,57.78 36.7,71.12 E10.16 | 57.66,19.05 57.66,8.26 U$1.DA2 | 119.89,17.78 74.17,17.78 72.9,19.05 57.66,19.05 | 119.89,17.78 127.51,17.78 127.51,8.26 U$1.CA2 | E7.14 119.89,60.33 119.89,17.78 | E6.14 173.86,148.59 110.36,148.59 E9.14